# EAGLE design AST1041 (EAGLE 6.3)
DATABASE: ./../../../../../Components/TinyCircuits_Part_Database.txt
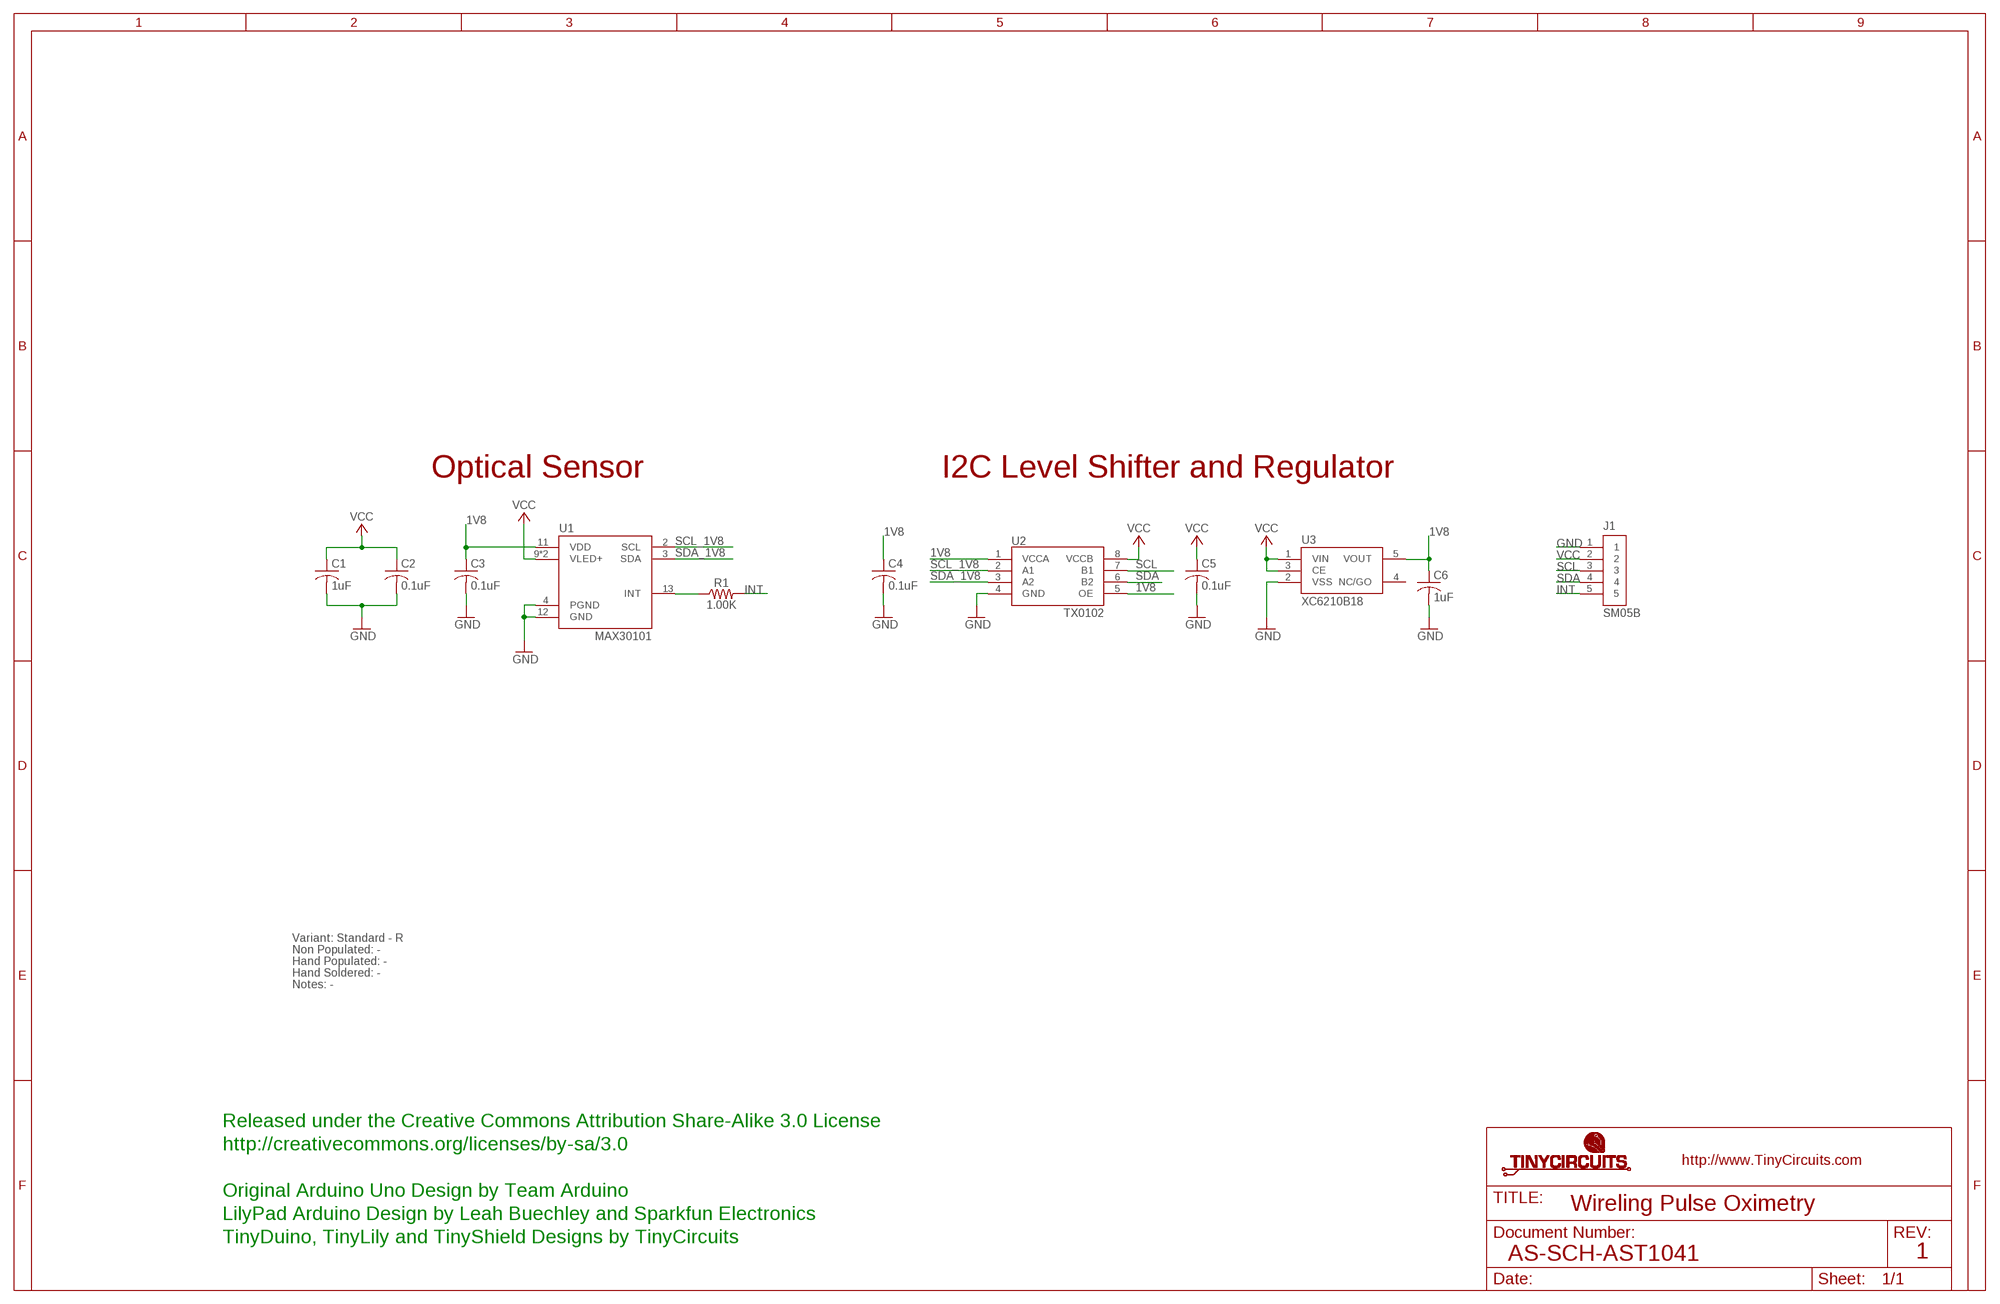
[diagram p0: schematic, sheet 1]

## Parts
C1  1uF  AS-ITM-00105  [C0402]
C2  0.1uF  AS-ITM-00008  [C0402]
C3  0.1uF  AS-ITM-00008  [C0402]
C4  0.1uF  AS-ITM-00008  [C0402]
C5  0.1uF  AS-ITM-00008  [C0402]
C6  1uF  AS-ITM-00105  [C0402]
J1  SM05B  AS-ITM-00340EDGE  [JST_SH_5X1_EDGE]
R1  1.00K  AS-ITM-00003  [0402]
U1  MAX30101  AS-ITM-00473  [MAX30100]
U2  TX0102  AS-ITM-00073  [DQE(R-PX2SON-N8)]
U3  XC6210B18  AS-ITM-00075  [SOT-25]

## Nets
1V8: C3.1 C4.1 C6.1 U1.11(VDD) U2.1(VCCA) U2.5(OE) U3.5(VOUT)
GND: C1.2 C2.2 C3.2 C4.2 C5.2 C6.2 J1.1 U1.4(PGND) U1.12(GND) U2.4(GND) U3.2(VSS)
INT: J1.5 R1.2
N$1: R1.1 U1.13(INT)
SCL: J1.3 U2.7(B1)
SCL_1V8: U1.2(SCL) U2.2(A1)
SDA: J1.4 U2.6(B2)
SDA_1V8: U1.3(SDA) U2.3(A2)
VCC: C1.1 C2.1 C5.1 J1.2 U1.9(VLED+) U1.10(VLED+) U2.8(VCCB) U3.1(VIN) U3.3(CE)
Unconnected: U3.4(NC/GO)

## Notes on the sheet
- Optical Sensor | I2C Level Shifter and Regulator
- Variant: Standard - R
- Non Populated: -
- Hand Populated: -
- Hand Soldered: -
- Notes: -
- Released under the Creative Commons Attribution Share-Alike 3.0 License
- http://creativecommons.org/licenses/by-sa/3.0
- Original Arduino Uno Design by Team Arduino
- Wireling Pulse Oximetry
- LilyPad Arduino Design by Leah Buechley and Sparkfun Electronics
- TinyDuino, TinyLily and TinyShield Designs by TinyCircuits
- AS-SCH-AST1041 | 1

## Library data of the parts
C1 C6 = tinycircuits:AS-ITM-00105: CAP CER 1UF 6.3V 10% X5R 0402; PARTNO: AS-ITM-00105
C2-C5 = tinycircuits:AS-ITM-00008: CAP CER 0.1UF 16V 10% X5R 0402; PARTNO: AS-ITM-00008
J1 = tinycircuits:AS-ITM-00340: CONN HEADER SH 5POS SIDE 1MM TIN; PARTNO: AS-ITM-00340; PNPROTATION: 180
R1 = tinycircuits:AS-ITM-00003: RES 1.00K OHM 1/16W 1% 0402; PARTNO: AS-ITM-00003
U1 = tinycircuits:AS-ITM-00473: INTEGRATED OPTICAL SENSOR; PARTNO: AS-ITM-00473
U2 = tinycircuits:AS-ITM-00073: TI 2-Bit Bidirectional Voltage-Level Translator; PARTNO: AS-ITM-00073; PNPROTATION: 0; VALUE: TXS0102
U3 = tinycircuits:AS-ITM-00075: IC REG LDO 1.8V .7A SOT-25; PARTNO: AS-ITM-00075; PNPROTATION: 270

## Net classes
2 gnd: width 0.305 mm, drill 0.559 mm, clearance 0.254 mm

## Board
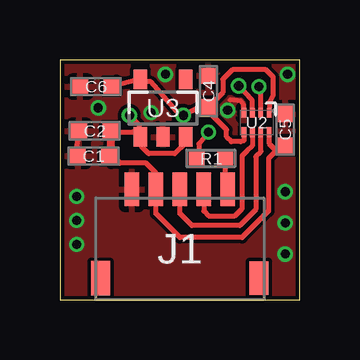
[diagram p1: board, top side]
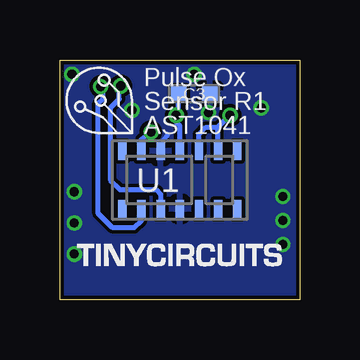
[diagram p2: board, bottom side, seen from below]

Size 10 x 10.01 mm. Coordinates in mm from the lower left corner, seen from the top.
Outline: 0,0.01 10,0 10,10 0,10.01 0,0.01
Copper layers (1*16): Top 0.035mm / dielectric 1.5mm / Bottom 0.035mm
Design rules "default *": minimum track width 7mil, minimum drill 15mil, track to track 6mil, track to pad 6mil, pad to pad 6mil, via to via 6mil, smd to smd 6mil, copper to edge 6mil, drill to drill 8mil, minimum pad ring 8mil, minimum via ring 5mil, stop-mask expansion 4mil, vias tented up to drill 25mil, thermal gap 10mil
tRestrict: 1 lines

### Footprints (pad centres in the part's own frame; a part is rotated, then mirrored left to right if it is on the bottom)
C0402 = smd 0.65 x 0.6: 1 -0.65,0; 2 0.65,0
JST_SH_5X1_EDGE = smd 0.6 x 1.4: 1 -2,2.475; 2 -1,2.475; 3 0,2.475; 4 1,2.475; 5 2,2.475 | smd 0.8 x 1.4: PAD1 -3.3,-1.225; PAD2 3.3,-1.225
0402 = smd 0.65 x 0.55: 1 -0.6,0; 2 0.6,0
MAX30100 = smd 0.75 x 0.35: 1 -1.2,2.4; 2 -1.2,1.6; 3 -1.2,0.8; 4 -1.2,0; 5 -1.2,-0.8; 6 -1.2,-1.6; 7 -1.2,-2.4; 8 1.2,-2.4; 9 1.2,-1.6; 10 1.2,-0.8; 11 1.2,0; 12 1.2,0.8; 13 1.2,1.6; 14 1.2,2.4
DQE(R-PX2SON-N8) = smd 0.2 x 0.4: 1 -0.525,-0.4; 2 -0.175,-0.4; 3 0.175,-0.4; 4 0.525,-0.4; 5 0.525,0.4; 6 0.175,0.4; 7 -0.175,0.4; 8 -0.525,0.4
SOT-25 = smd 0.55 x 0.8: 1 -0.95,-1.2; 2 0,-1.2; 3 0.95,-1.2; 4 0.95,1.2; 5 -0.95,1.2

### Placement (x,y rotation side)
C1  1.4,6 180 top
C2  1.45,7.05 180 top
C3  4.4,8.6 0 bottom
C4  6.2,8.7 90 top
C5  9.4,7.1 90 top
C6  1.5,8.9 180 top
J1  5,2.14 0 top
R1  6.3,5.9 0 top
U1  5,5 90 bottom
U2  8.2,7.4 180 top
U3  4.3,8 0 top
U$1  [DOCFIELD-TINYCIRCUITS-PCB]  29,-14 0 top  (outside the outline)

### Tracks (layer width: path | path; a pad name or v marks a point on that pad's centre or on a via)
1V8  (via drill 0.38)
  Top 0.2: 8.9,8.55 8.73,8.23 U2.1 | U2.5 7.68,6.62 7.55,6.6 7.15,6.6 6.95,6.8 6.95,7.1
  Top 0.203: C4.1 5.75,8 v5.15,7.7 5,7.7 3.8,9.1 3.45,9.1 U3.5 C6.1 2.35,9.15 2.1,8.9 | 6.95,7.1 6.35,7.7 C4.1 | 8.9,8.55 8.9,9.3 8.6,9.6 7.2,9.6 6.8,9.2 6.8,8.65 C4.1
  Bottom 0.203: U1.11 5,7.25 5.15,7.4 v5.15,7.7 5.05,7.7 C3.1
GND  (via drill 0.38)
  Top 0.2: U2.4 7.68,8.12 7.55,8.3 7.1,8.35
  Top 0.203: C2.2 0.6,5.85 C1.2
  Bottom 0.203: 5.8,6.5 5.5,6.9
  other vias: 9.4,1.91 0.7,2.31 0.7,4.31 4.4,9.41 0.7,3.31 9.4,4.51 9.5,9.41 9.4,3.21 7,7.91 3.8,7.81 1.6,8.01
  pour Bottom: 0,10 10,10 10,0 0,0
  pour Top: 0,10 10,10 10,0 0,0
INT
  Top 0.203: J1.5 6.9,4.71 R1.2
N$1  (via drill 0.38)
  Top 0.203: v6.2,7 5.8,6.5 5.8,6 R1.1
  Bottom 0.203: U1.13 6.6,6.7 v6.2,7
SCL
  Top 0.2: 8.38,6.23 U2.7
  Top 0.203: 8.38,6.23 8.38,6.18 8.18,5.98 8.18,3.77 7.5,3.1 5.5,3.1 5,3.6 J1.3
SCL_1V8  (via drill 0.38)
  Top 0.2: U2.2 8.38,8.82 8.3,9
  Top 0.203: v8.3,8.9 8.2,9.1 8.3,9
  Bottom 0.203: U1.2 6.6,3.3 6.9,3 7.8,3 8.4,3.6 8.4,8.2 8.2,8.4 8.2,8.8 v8.3,8.9
SDA
  Top 0.2: U2.6 8.02,6.43 7.8,6.2
  Top 0.203: J1.4 6,3.7 6.2,3.5 7.3,3.5 7.6,3.8 7.6,6 7.8,6.2
SDA_1V8  (via drill 0.38)
  Top 0.2: U2.3 8.02,8.32
  Top 0.203: 8.02,8.32 v7.46,8.93 | v7.46,8.93 7.32,8.98 7.26,8.94 v7.46,8.93
  Bottom 0.203: v7.46,8.93 7.26,8.94 7.3,8.9 7.52,8.66 7.52,8.38 7.9,8 7.9,5 7.5,4.6 6,4.6 5.8,4.4 U1.3
VCC  (via drill 0.38)
  Top 0.2: U2.8 8.73,6.52 8.95,6.3
  Top 0.203: C2.1 2.05,6.2 C1.1 2.15,5.7 2.5,5.7 | 9.15,6.3 9.15,6.35 8.7,5.9 8.7,3.7 7.6,2.6 5,2.6 4,3.6 J1.2 4,5.3 3.6,5.7 2.5,5.7 | 8.95,6.3 9.15,6.3 | 9.15,6.3 C5.1 | v2.9,7.7 3.3,7.3 3.3,6.85 U3.1 | 2.5,5.7 2.2,6 2.2,6.9 2.1,7 3.05,7 U3.1 | U3.3 5.25,6.55 4.8,6.1 3.7,6.1 3.4,6.4 3.4,6.75 U3.1
  Bottom 0.203: U1.9 3.4,7.2 | 3.4,7.2 v2.9,7.7 | U1.10 4.2,6.9 3.9,7.2 3.4,7.2

### Text on the board
bPlace: Pulse Ox | Sensor R1 | AST1041
Document: FABRICATION DRAWING | NOTES: | 1. PRINTED CIRCUIT BOARD MADE FROM NEMA GRADE FR-4 EPOXY LAMINATE | WITH 1 OUNCE COPPER PLATING AND .024 THICKNESS. | 2. ALL DIMENSIONS ARE GIVEN IN MILLIMETERS. | 3. CIRCUIT PATHS ARE FOR REFERENCE ONLY. | 4. HOLE SIZES SHOWN ARE FINISHED DIAMETERS AFTER PLATING. | 5. BOARD PLATED USING REFLOW OR SIMILAR METHOD. | 6. BOARD TO HAVE BLUE SOLDER MASK ON PLATED SURFACES USING WET FILM | 7. SILKSCREEN BOARD USING WHITE INK. | SR100 OR SR1010 EPOXY. EQUIVALENT WET OR DRY FILM MAY BE USED. | 8. THE FOLLOWING INFORMATION APPLIES TO THIS BOARD: | * 2 COPPER LAYERS | * .024 BOARD THICKNESS | * REQUIRES TOP SIDE SILKSCREEN | Released under the Creative Commons Attribution Share-Alike 3.0 License | http://creativecommons.org/licenses/by-sa/3.0 | Original Arduino Uno Design by Team Arduino | LilyPad Arduino Design by Leah Buechley and Sparkfun Electronics | TinyDuino, TinyLily and TinyShield Designs by TinyCircuits | Wireling Pulse Oximetry | AS-PCB-AST1041 | 1